# Altium schematic sheet TOP_SHEET.SchDoc
size A3
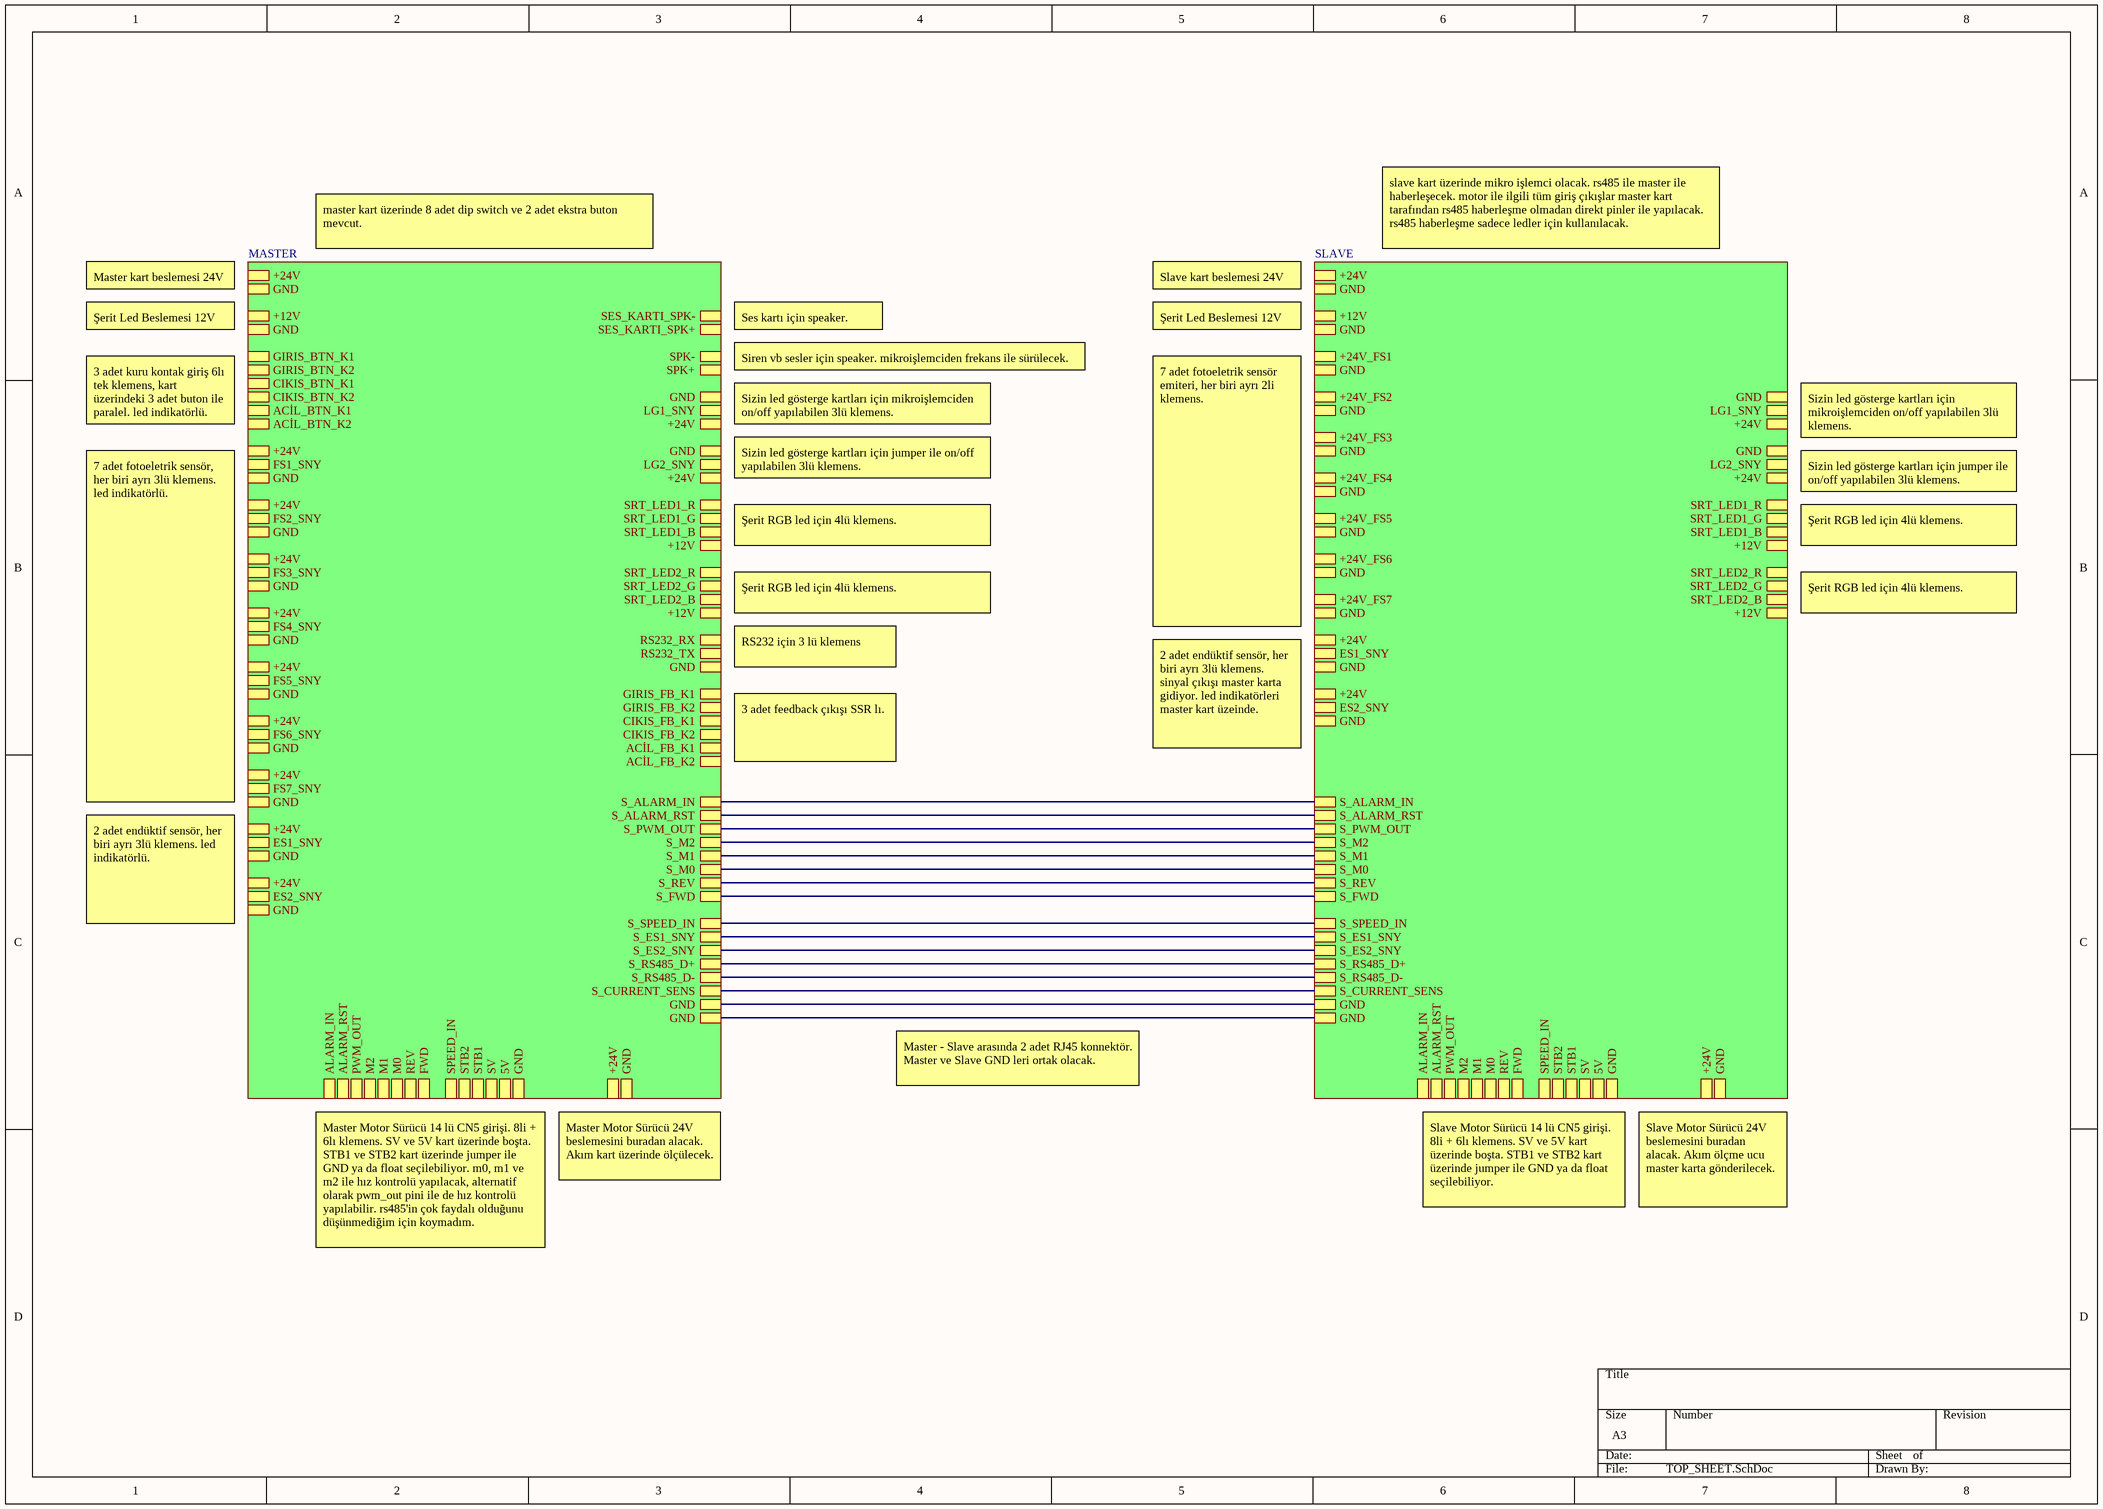
[diagram p0: TOP_SHEET.SchDoc]

## Sub-sheets
MASTER = File Name: +12V, GND, GIRIS_BTN_K1, GIRIS_BTN_K2, CIKIS_BTN_K1, CIKIS_BTN_K2, ACİL_BTN_K1, ACİL_BTN_K2, +24V, FS1_SNY, GND, +24V, FS2_SNY, GND, +24V, FS3_SNY, GND, +24V, FS4_SNY, GND, +24V, FS5_SNY, GND, +24V, FS6_SNY, GND, +24V, FS7_SNY, GND, +24V, ES1_SNY, GND, +24V, ES2_SNY, GND, ALARM_IN, ALARM_RST, PWM_OUT, M2, M1, M0, REV, FWD, SPEED_IN, STB2, STB1, SV, 5V, GND, +24V, GND, SES_KARTI_SPK-, SES_KARTI_SPK+, SPK-, SPK+, GND, LG1_SNY, +24V, GND, LG2_SNY, +24V, SRT_LED1_R, SRT_LED1_G, SRT_LED1_B, +12V, SRT_LED2_R, SRT_LED2_G, SRT_LED2_B, +12V, RS232_RX, RS232_TX, GND, GIRIS_FB_K1, GIRIS_FB_K2, CIKIS_FB_K1, CIKIS_FB_K2, ACİL_FB_K1, ACİL_FB_K2, S_ALARM_IN, S_ALARM_RST, S_PWM_OUT, S_M2, S_M1, S_M0, S_REV, S_FWD, S_SPEED_IN, S_ES1_SNY, S_ES2_SNY, S_RS485_D+, S_RS485_D-, S_CURRENT_SENS, GND, GND, +24V, GND
SLAVE = File Name: +12V, GND, +24V_FS1, GND, +24V_FS2, GND, +24V_FS3, GND, +24V_FS4, GND, +24V_FS5, GND, +24V_FS6, GND, +24V_FS7, GND, +24V, ES1_SNY, GND, +24V, ES2_SNY, GND, GND, LG1_SNY, +24V, GND, LG2_SNY, +24V, SRT_LED1_R, SRT_LED1_G, SRT_LED1_B, +12V, SRT_LED2_R, SRT_LED2_G, SRT_LED2_B, +12V, S_ALARM_IN, S_ALARM_RST, S_PWM_OUT, S_M2, S_M1, S_M0, S_REV, S_FWD, S_SPEED_IN, S_ES1_SNY, S_ES2_SNY, S_RS485_D+, S_RS485_D-, S_CURRENT_SENS, GND, GND, ALARM_IN, ALARM_RST, PWM_OUT, M2, M1, M0, REV, FWD, SPEED_IN, STB2, STB1, SV, 5V, GND, +24V, GND, +24V, GND

## Nets
(unnamed): sheet MASTER/S_ALARM_IN, sheet SLAVE/S_ALARM_IN
(unnamed): sheet MASTER/S_ALARM_RST, sheet SLAVE/S_ALARM_RST
(unnamed): sheet MASTER/S_PWM_OUT, sheet SLAVE/S_PWM_OUT
(unnamed): sheet MASTER/S_M2, sheet SLAVE/S_M2
(unnamed): sheet MASTER/S_M1, sheet SLAVE/S_M1
(unnamed): sheet MASTER/S_M0, sheet SLAVE/S_M0
(unnamed): sheet MASTER/S_REV, sheet SLAVE/S_REV
(unnamed): sheet MASTER/S_FWD, sheet SLAVE/S_FWD
(unnamed): sheet MASTER/S_SPEED_IN, sheet SLAVE/S_SPEED_IN
(unnamed): sheet MASTER/S_ES1_SNY, sheet SLAVE/S_ES1_SNY
(unnamed): sheet MASTER/S_ES2_SNY, sheet SLAVE/S_ES2_SNY
(unnamed): sheet MASTER/S_RS485_D+, sheet SLAVE/S_RS485_D+
(unnamed): sheet MASTER/S_RS485_D-, sheet SLAVE/S_RS485_D-
(unnamed): sheet MASTER/S_CURRENT_SENS, sheet SLAVE/S_CURRENT_SENS
(unnamed): sheet MASTER/GND, sheet SLAVE/GND
(unnamed): sheet MASTER/GND, sheet SLAVE/GND

## Notes on the sheet
- master kart üzerinde 8 adet dip switch ve 2 adet ekstra buton mevcut.
- slave kart üzerinde mikro işlemci olacak. rs485 ile master ile haberleşecek. motor ile ilgili tüm giriş çıkışlar master kart tarafından rs485 haberleşme olmadan direkt pinler ile yapılacak. rs485 haberleşme sadece ledler için kullanılacak.
- Master kart beslemesi 24V
- Slave kart beslemesi 24V
- Şerit Led Beslemesi 12V
- Ses kartı için speaker.
- Siren vb sesler için speaker. mikroişlemciden frekans ile sürülecek.
- 3 adet kuru kontak giriş 6lı tek klemens, kart üzerindeki 3 adet buton ile paralel. led indikatörlü.
- Sizin led gösterge kartları için mikroişlemciden on/off yapılabilen 3lü klemens.
- Sizin led gösterge kartları için jumper ile on/off yapılabilen 3lü klemens.
- Şerit RGB led için 4lü klemens.
- 7 adet fotoeletrik sensör emiteri, her biri ayrı 2li klemens.
- RS232 için 3 lü klemens
- 3 adet feedback çıkışı SSR lı.
- 2 adet endüktif sensör, her biri ayrı 3lü klemens. sinyal çıkışı master karta gidiyor. led indikatörleri master kart üzeinde.
- 7 adet fotoeletrik sensör, her biri ayrı 3lü klemens. led indikatörlü.
- 2 adet endüktif sensör, her biri ayrı 3lü klemens. led indikatörlü.
- Master - Slave arasında 2 adet RJ45 konnektör. Master ve Slave GND leri ortak olacak.
- Master Motor Sürücü 24V beslemesini buradan alacak. Akım kart üzerinde ölçülecek.
- Master Motor Sürücü 14 lü CN5 girişi. 8li + 6lı klemens. SV ve 5V kart üzerinde boşta. STB1 ve STB2 kart üzerinde jumper ile GND ya da float seçilebiliyor. m0, m1 ve m2 ile hız kontrolü yapılacak, alternatif olarak pwm_out pini ile de hız kontrolü yapılabilir. rs485'in çok faydalı olduğunu düşünmediğim için koymadım.
- Slave Motor Sürücü 14 lü CN5 girişi. 8li + 6lı klemens. SV ve 5V kart üzerinde boşta. STB1 ve STB2 kart üzerinde jumper ile GND ya da float seçilebiliyor.
- Slave Motor Sürücü 24V beslemesini buradan alacak. Akım ölçme ucu master karta gönderilecek.